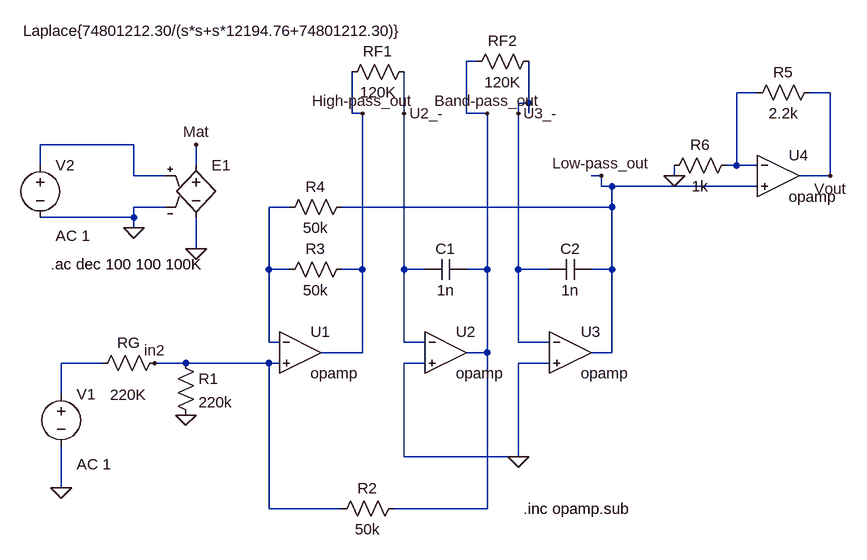
[diagram p0: schematic TPL.asc]
TPL.asc, the LTspice schematic file:
Version 4
SHEET 1 1836 1000
WIRE 896 -176 880 -176
WIRE 1328 -128 1296 -128
WIRE 1440 -128 1408 -128
WIRE 976 -112 976 -176
WIRE 976 -112 960 -112
WIRE 704 -96 704 -160
WIRE 720 -96 704 -96
WIRE 784 -96 784 -160
WIRE 880 -96 880 -176
WIRE 912 -96 880 -96
WIRE 960 -96 960 -112
WIRE 976 -96 976 -112
WIRE 368 -48 224 -48
WIRE 224 -16 224 -48
WIRE 464 -16 464 -48
WIRE 1296 -16 1296 -128
WIRE 1296 -16 1280 -16
WIRE 1328 -16 1296 -16
WIRE 368 0 368 -48
WIRE 416 0 368 0
WIRE 1088 0 1072 0
WIRE 1200 0 1200 -16
WIRE 1440 0 1440 -128
WIRE 1440 0 1392 0
WIRE 1088 16 1088 0
WIRE 1104 16 1088 16
WIRE 1328 16 1104 16
WIRE 416 48 368 48
WIRE 608 48 576 48
WIRE 1104 48 1104 16
WIRE 1104 48 688 48
WIRE 368 64 368 48
WIRE 368 64 224 64
WIRE 368 80 368 64
WIRE 464 112 464 64
WIRE 576 144 576 48
WIRE 608 144 576 144
WIRE 720 144 720 -96
WIRE 720 144 688 144
WIRE 784 144 784 -96
WIRE 816 144 784 144
WIRE 912 144 912 -96
WIRE 912 144 880 144
WIRE 960 144 960 -96
WIRE 1008 144 960 144
WIRE 1104 144 1104 48
WIRE 1104 144 1072 144
WIRE 576 256 576 144
WIRE 592 256 576 256
WIRE 784 256 784 144
WIRE 816 256 784 256
WIRE 960 256 960 144
WIRE 1008 256 960 256
WIRE 720 272 720 144
WIRE 720 272 656 272
WIRE 912 272 912 144
WIRE 912 272 880 272
WIRE 1104 272 1104 144
WIRE 1104 272 1072 272
WIRE 320 288 256 288
WIRE 448 288 400 288
WIRE 576 288 448 288
WIRE 592 288 576 288
WIRE 816 288 784 288
WIRE 1008 288 960 288
WIRE 256 336 256 288
WIRE 784 432 784 288
WIRE 960 432 960 288
WIRE 960 432 784 432
WIRE 256 480 256 416
WIRE 576 512 576 288
WIRE 688 512 576 512
WIRE 912 512 912 272
WIRE 912 512 768 512
FLAG 400 288 in2
FLAG 960 432 0
FLAG 1088 0 Low-pass_out
FLAG 912 -96 Band-pass_out
FLAG 720 -96 High-pass_out
FLAG 784 -96 U2_-
FLAG 960 -96 U3_-
FLAG 256 480 0
FLAG 448 368 0
FLAG 368 80 0
FLAG 464 -48 Mat
FLAG 464 112 0
FLAG 1200 0 0
FLAG 1440 0 Vout
SYMBOL voltage 256 320 R0
WINDOW 123 24 124 Left 2
WINDOW 39 0 0 Left 2
SYMATTR Value2 AC 1
SYMATTR InstName V1
SYMATTR Value ""
SYMBOL res 304 304 R270
WINDOW 0 32 56 VTop 2
WINDOW 3 -17 56 VBottom 2
SYMATTR InstName RG
SYMATTR Value 220K
SYMBOL res 672 528 R270
WINDOW 0 32 56 VTop 2
WINDOW 3 0 56 VBottom 2
SYMATTR InstName R2
SYMATTR Value 50k
SYMBOL res 592 160 R270
WINDOW 0 32 56 VTop 2
WINDOW 3 0 56 VBottom 2
SYMATTR InstName R3
SYMATTR Value 50k
SYMBOL res 592 64 R270
WINDOW 0 32 56 VTop 2
WINDOW 3 0 56 VBottom 2
SYMATTR InstName R4
SYMATTR Value 50k
SYMBOL cap 816 160 R270
WINDOW 0 32 32 VTop 2
WINDOW 3 0 32 VBottom 2
SYMATTR InstName C1
SYMATTR Value 1n
SYMBOL cap 1008 160 R270
WINDOW 0 32 32 VTop 2
WINDOW 3 0 32 VBottom 2
SYMATTR InstName C2
SYMATTR Value 1n
SYMBOL res 688 -144 R270
WINDOW 0 32 56 VTop 2
WINDOW 3 0 56 VBottom 2
SYMATTR InstName RF1
SYMATTR Value 120K
SYMBOL res 880 -160 R270
WINDOW 0 32 56 VTop 2
WINDOW 3 0 56 VBottom 2
SYMATTR InstName RF2
SYMATTR Value 120K
SYMBOL OpAmps\\opamp 624 208 R0
SYMATTR InstName U1
SYMBOL OpAmps\\opamp 848 208 R0
SYMATTR InstName U2
SYMBOL OpAmps\\opamp 1040 208 R0
SYMATTR InstName U3
SYMBOL res 432 272 R0
SYMATTR InstName R1
SYMATTR Value 220k
SYMBOL voltage 224 -32 R0
WINDOW 123 24 124 Left 2
WINDOW 39 0 0 Left 0
SYMATTR Value2 AC 1
SYMATTR InstName V2
SYMATTR Value ""
SYMBOL e 464 -32 R0
WINDOW 3 -266 -191 Left 2
SYMATTR Value Laplace{74801212.30/(s*s+s*12194.76+74801212.30)}
SYMATTR InstName E1
SYMBOL OpAmps\\opamp 1360 -64 R0
SYMATTR InstName U4
SYMBOL res 1424 -144 R90
WINDOW 0 0 56 VBottom 2
WINDOW 3 32 56 VTop 2
SYMATTR InstName R5
SYMATTR Value 2.2k
SYMBOL res 1296 -32 R90
WINDOW 0 0 56 VBottom 2
WINDOW 3 32 56 VTop 2
SYMATTR InstName R6
SYMATTR Value 1k
TEXT 968 512 Left 2 !.inc opamp.sub
TEXT 240 136 Left 2 !.ac dec 100 100 100K

The netlist it stands for:
* TPL.asc
V1 N004 0 AC 1
RG N004 in2 220K
R2 in2 Band-pass_out 50k
R3 N003 High-pass_out 50k
R4 N003 Low-pass_out 50k
C1 U2_- Band-pass_out 1n
C2 U3_- Low-pass_out 1n
RF1 High-pass_out U2_- 120K
RF2 Band-pass_out U3_- 120K
XU1 N003 in2 High-pass_out opamp Aol=100K GBW=10Meg  ; pins invin noninvin out
XU2 U2_- 0 Band-pass_out opamp Aol=100K GBW=10Meg  ; pins invin noninvin out
XU3 U3_- 0 Low-pass_out opamp Aol=100K GBW=10Meg  ; pins invin noninvin out
R1 in2 0 220k
V2 N002 0 AC 1
E1 Mat 0 N002 0 Laplace{74801212.30/(s*s+s*12194.76+74801212.30)}
XU4 N001 Low-pass_out Vout opamp Aol=100K GBW=10Meg  ; pins invin noninvin out
R5 Vout N001 2.2k
R6 N001 0 1k
.inc opamp.sub
.ac dec 100 100 100K
.backanno
.end

* Results of the author's LTspice run, read from the files saved beside the schematic
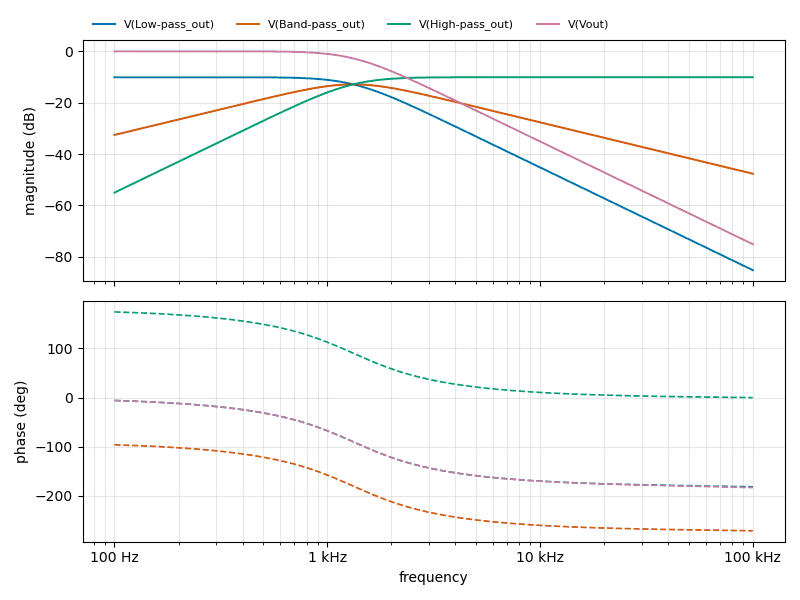
[diagram p1: AC Analysis of TPL.asc, plotted from the saved traces]
* AC Analysis, 1 run:
*   V(Low-pass_out): -10.10 dB at 100 Hz, -85.20 dB at 100 kHz, peak -10.09 dB at 309 Hz, 3 dB below the peak at 1.361 kHz
*   V(Band-pass_out): -32.55 dB at 100 Hz, -47.65 dB at 100 kHz, peak -12.87 dB at 1.318 kHz, 3 dB below the peak at 697.8 Hz and 2.522 kHz
*   V(High-pass_out): -55.00 dB at 100 Hz, -10.10 dB at 100 kHz, peak -10.09 dB at 5.623 kHz, 3 dB below the peak at 1.292 kHz
*   V(Vout): 0.00 dB at 100 Hz, -75.10 dB at 100 kHz, peak 0.01 dB at 309 Hz, 3 dB below the peak at 1.361 kHz